# Altium schematic sheet RECTIFIER_SHUTDOWN_CCT.SchDoc
size A4
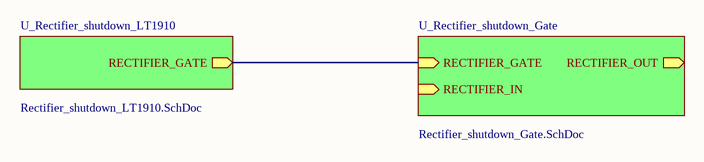
[diagram p0: RECTIFIER_SHUTDOWN_CCT.SchDoc]

## Sub-sheets
U_Rectifier_shutdown_Gate = Rectifier_shutdown_Gate.SchDoc: RECTIFIER_OUT (out), RECTIFIER_IN (in), RECTIFIER_GATE (in)
U_Rectifier_shutdown_LT1910 = Rectifier_shutdown_LT1910.SchDoc: RECTIFIER_GATE (out)

## Nets
(unnamed): sheet U_Rectifier_shutdown_Gate/RECTIFIER_GATE, sheet U_Rectifier_shutdown_LT1910/RECTIFIER_GATE